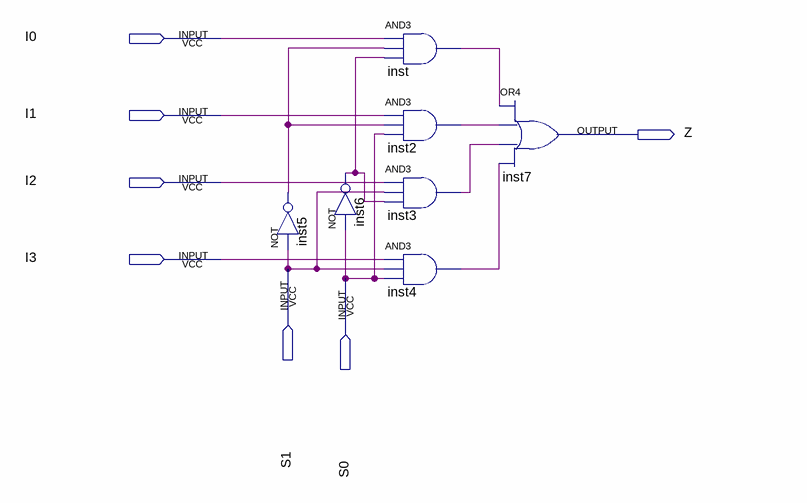
[diagram p0: schematic sheet]
// Quartus schematic s1113341_lab02_3.bdf as structural Verilog: 7 symbols, 7 pins
module s1113341_lab02_3 (
  input  I0,
  input  I1,
  input  I2,
  input  I3,
  input  S1,
  input  S0,
  output Z
);

  wire inst2_out, inst3_out, inst4_out, inst5_out, inst6_out, inst_out;

  not inst5 (inst5_out, S1);
  not inst6 (inst6_out, S0);
  and inst (inst_out, I0, inst5_out, inst6_out);
  and inst2 (inst2_out, I1, inst5_out, S0);
  and inst3 (inst3_out, I2, S1, inst6_out);
  and inst4 (inst4_out, I3, S1, S0);
  or inst7 (Z, inst_out, inst2_out, inst3_out, inst4_out);
endmodule
